# EAGLE design plus-alt (EAGLE 9.6.2)
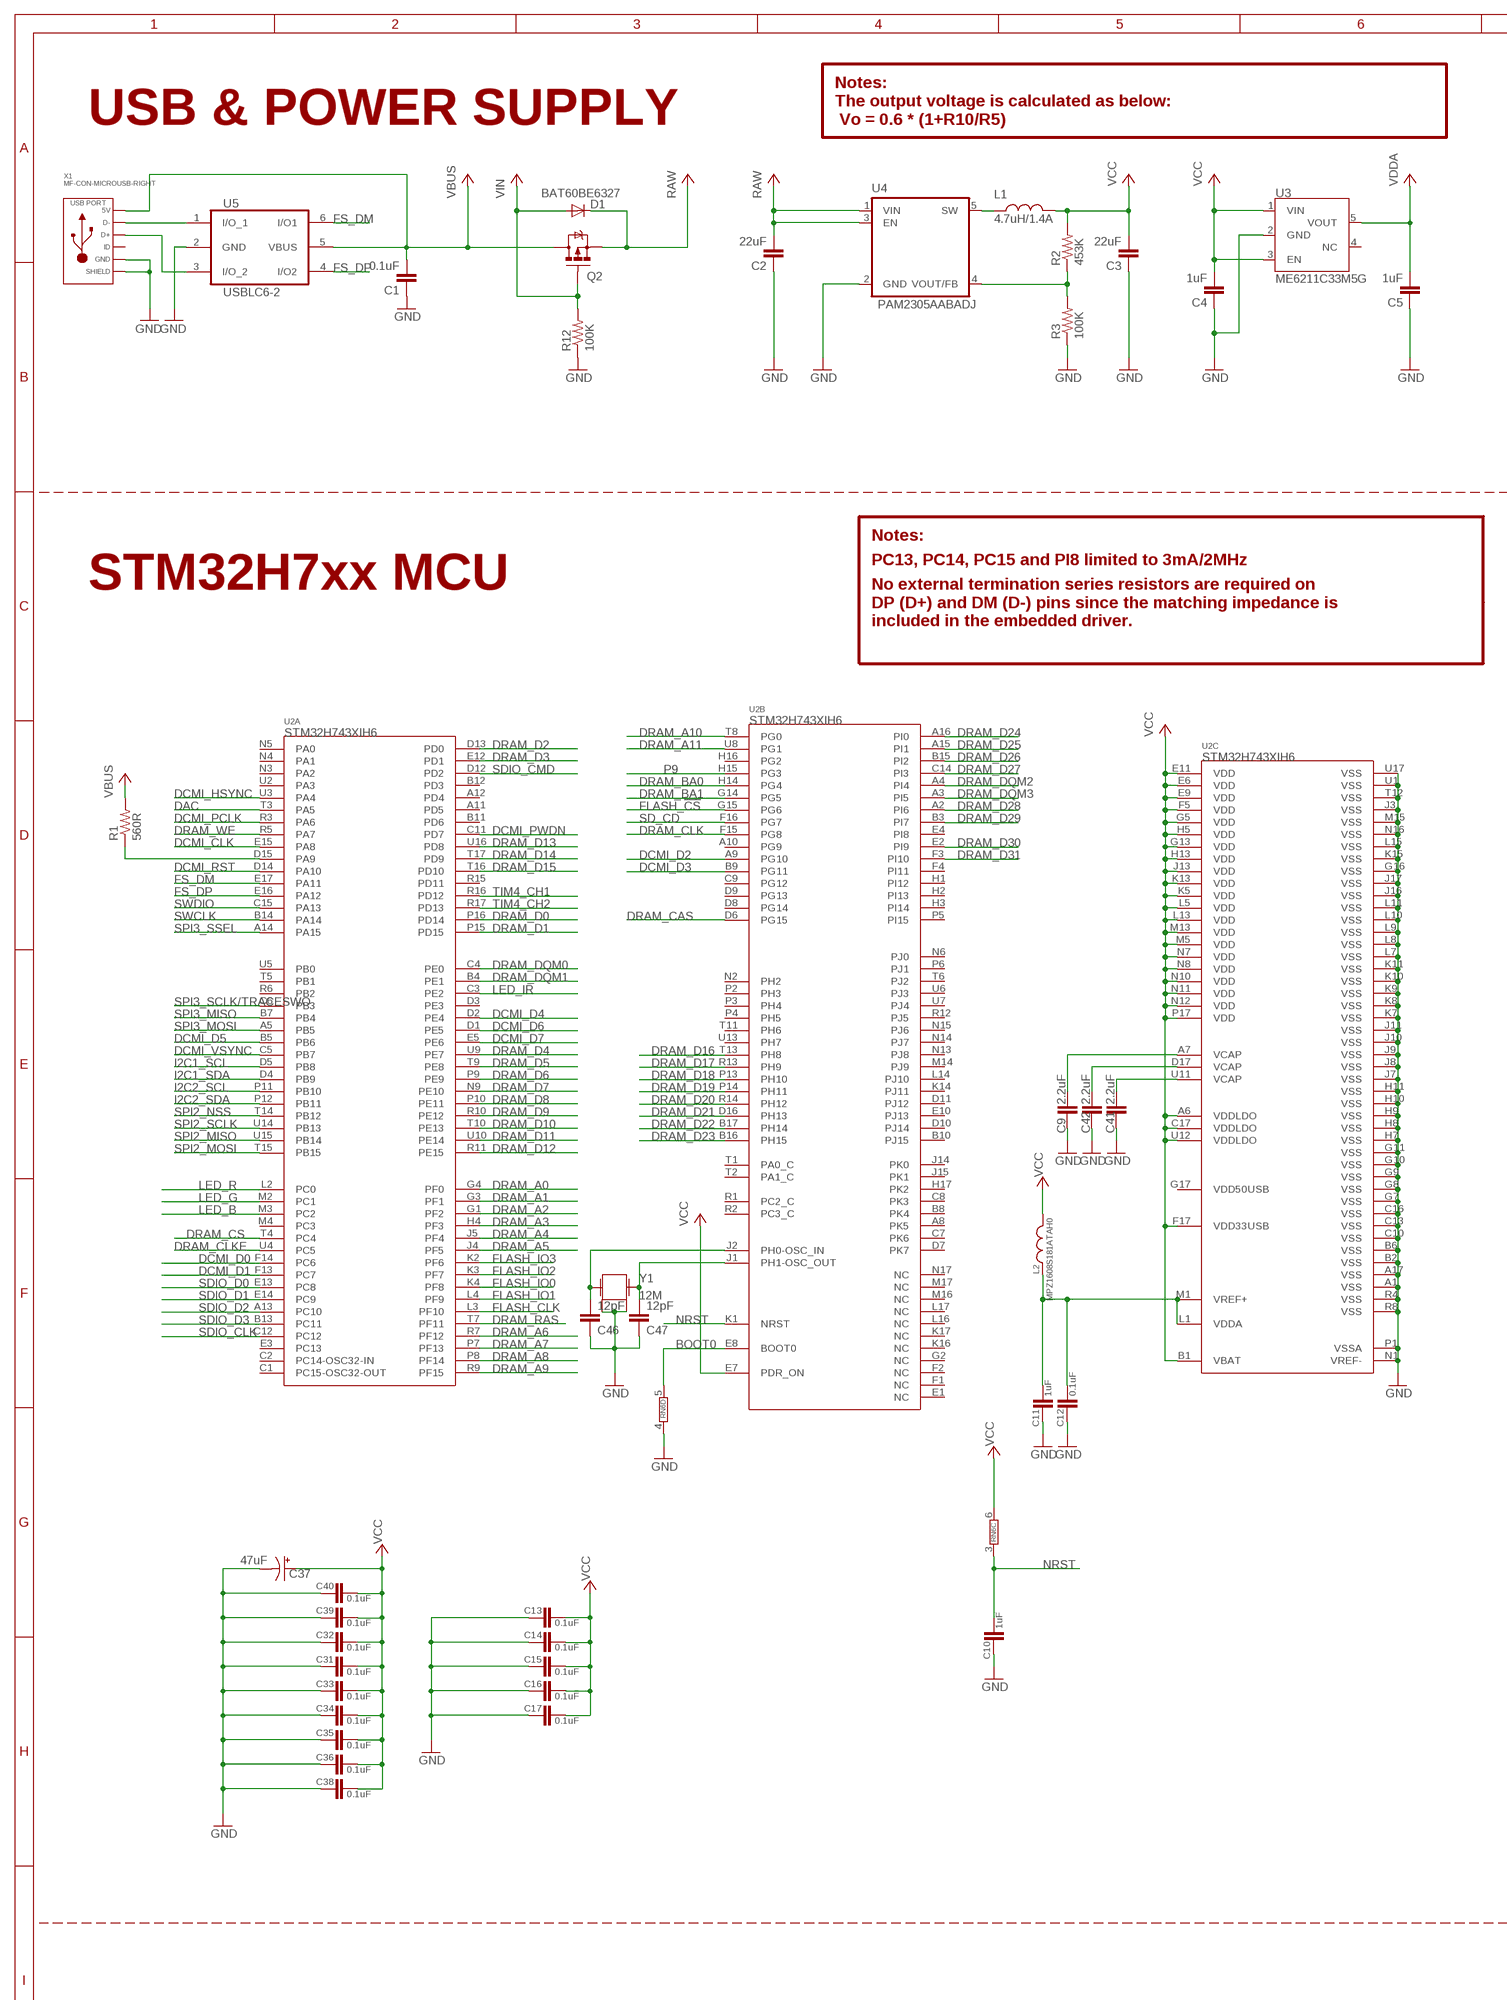
[diagram p0: schematic, sheet 1, part 1 of 2]
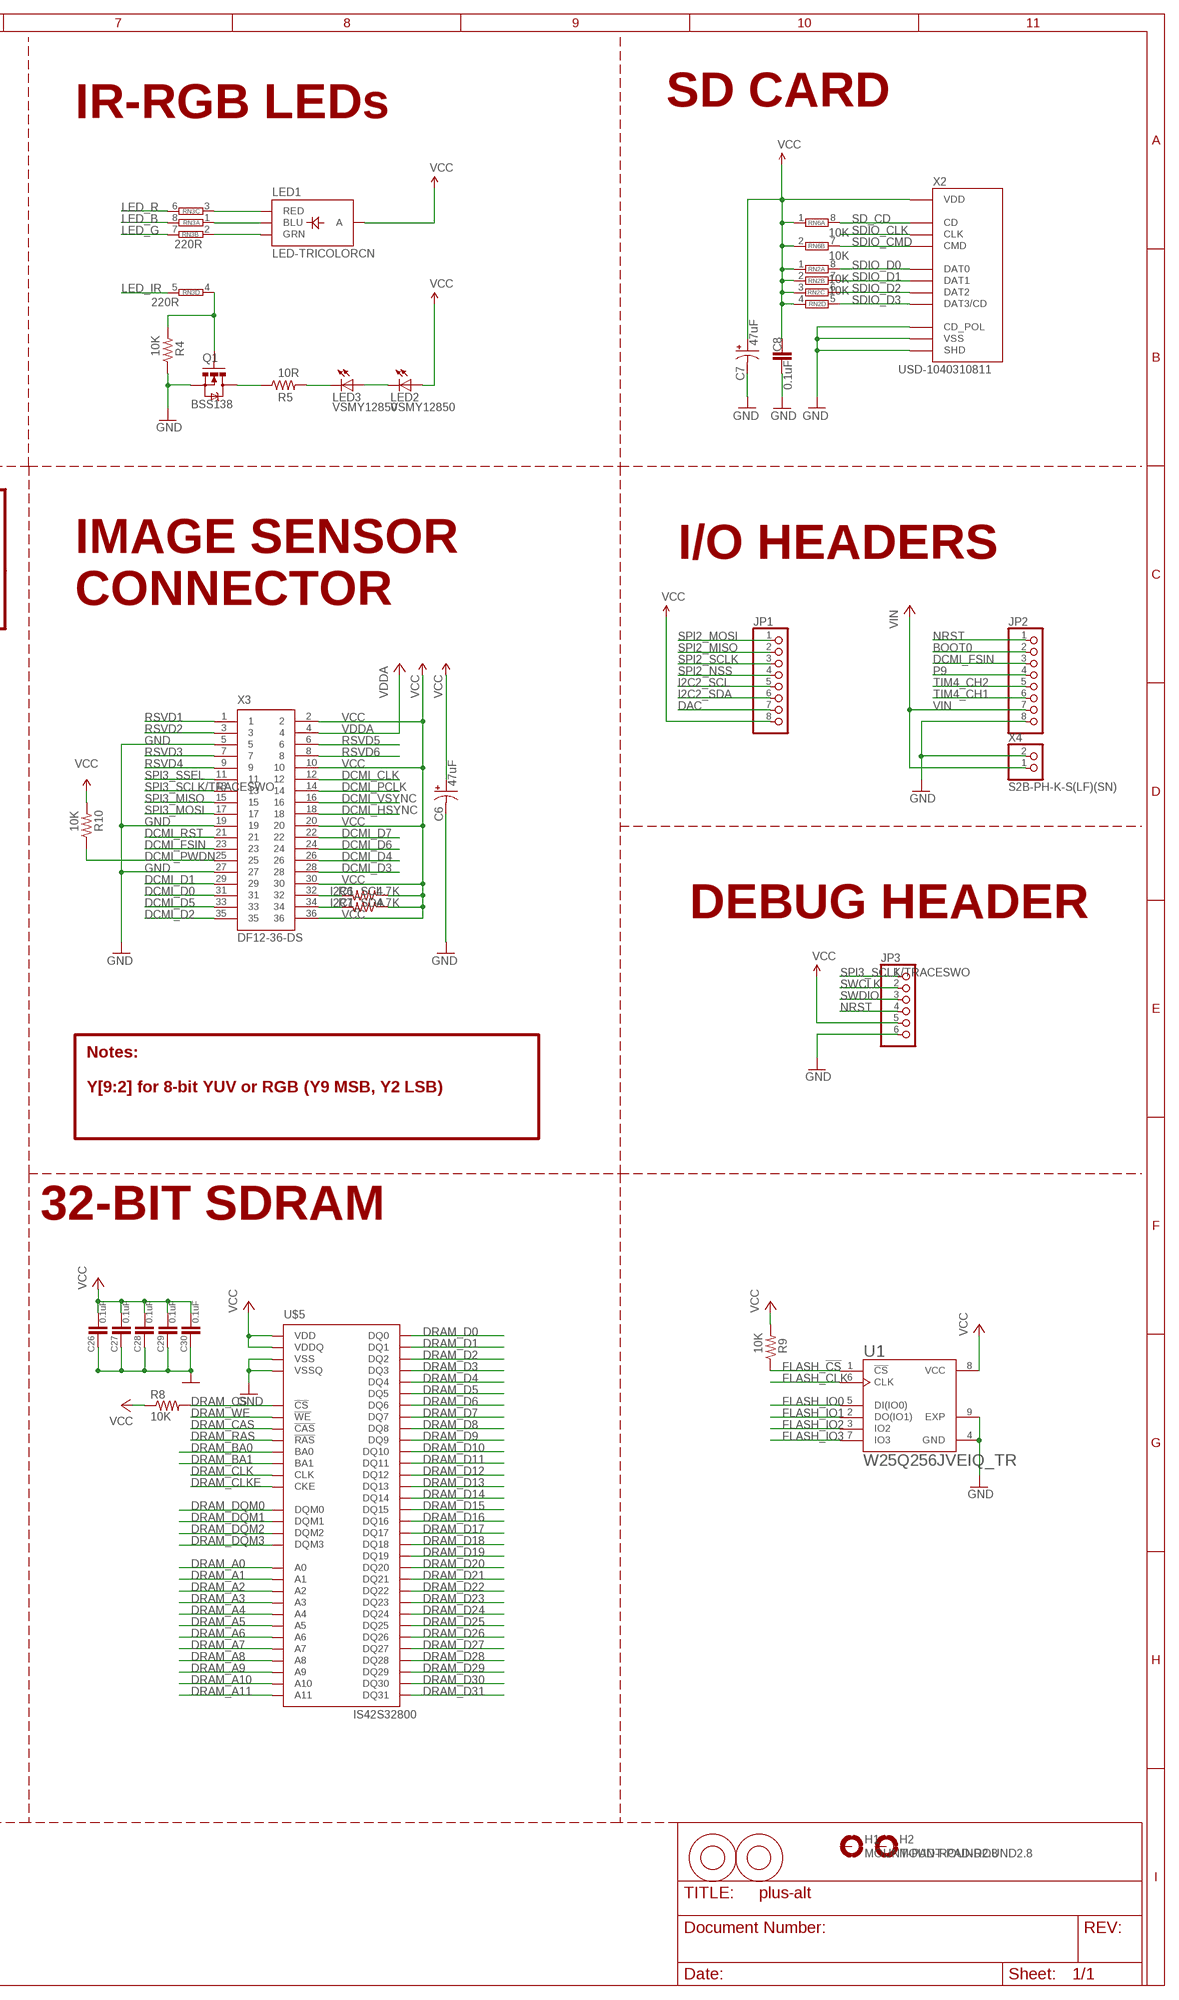
[diagram p1: schematic, sheet 1, part 2 of 2]

## Parts
C1  0.1uF  CAP0402-CAP  [0402-CAP]
C2  22uF  CAP0805  [0805]
C3  22uF  CAP0805  [0805]
C4  1uF  CAP0402-CAP  [0402-CAP]
C5  1uF  CAP0402-CAP  [0402-CAP]
C6  47uF  CAP_POL1206  [EIA3216]
C7  47uF  CAP_POL1206  [EIA3216]
C8  0.1uF  CAP0402-CAP  [0402-CAP]
C9  2.2uF  CAP0402-CAP  [0402-CAP]
C10  1uF  CAP0402-CAP  [0402-CAP]
C11  1uF  CAP0402-CAP  [0402-CAP]
C12  0.1uF  CAP0402-CAP  [0402-CAP]
C13  0.1uF  CAP0402-CAP  [0402-CAP]
C14  0.1uF  CAP0402-CAP  [0402-CAP]
C15  0.1uF  CAP0402-CAP  [0402-CAP]
C16  0.1uF  CAP0402-CAP  [0402-CAP]
C17  0.1uF  CAP0402-CAP  [0402-CAP]
C26  0.1uF  CAP0402-CAP  [0402-CAP]
C27  0.1uF  CAP0402-CAP  [0402-CAP]
C28  0.1uF  CAP0402-CAP  [0402-CAP]
C29  0.1uF  CAP0402-CAP  [0402-CAP]
C30  0.1uF  CAP0402-CAP  [0402-CAP]
C31  0.1uF  CAP0402-CAP  [0402-CAP]
C32  0.1uF  CAP0402-CAP  [0402-CAP]
C33  0.1uF  CAP0402-CAP  [0402-CAP]
C34  0.1uF  CAP0402-CAP  [0402-CAP]
C35  0.1uF  CAP0402-CAP  [0402-CAP]
C36  0.1uF  CAP0402-CAP  [0402-CAP]
C37  47uF  CAP_POL1206  [EIA3216]
C38  0.1uF  CAP0402-CAP  [0402-CAP]
C39  0.1uF  CAP0402-CAP  [0402-CAP]
C40  0.1uF  CAP0402-CAP  [0402-CAP]
C41  2.2uF  CAP0402-CAP  [0402-CAP]
C42  2.2uF  CAP0402-CAP  [0402-CAP]
C46  12pF  CAP0402-CAP  [0402-CAP]
C47  12pF  CAP0402-CAP  [0402-CAP]
D1  BAT60BE6327  DIODESOD  [SOD-323]
H1  MOUNT-PAD-ROUND2.8  [2,8-PAD]
H2  MOUNT-PAD-ROUND2.8  [2,8-PAD]
JP1  PINHD-1X8  [1X08]
JP2  PINHD-1X8  [1X08]
JP3  PINHD-1X6  [1X06]
L1  4.7uH/1.4A  INDUCTOR1007  [1007]
L2  MPZ1608S181ATAH0  INDUCTOR0402  [C0402]
LED1  LED-TRICOLORCN  [LED-TRICOLOR-SMD]
LED2  VSMY12850  LED1206  [LED-1206]
LED3  VSMY12850  LED1206  [LED-1206]
M1  9774030243R  9774030151R  [9774030151R]
M2  9774030243R  9774030151R  [9774030151R]
Q1  BSS138  MOSFET-NCHANNELSMD  [SOT23-3]
Q2  AO3401  MOSFET-PCHANNELSMD  [SOT23-3]
R1  560R  RESISTOR0402-RES  [0402-RES]
R2  453K  RESISTOR0402-RES  [0402-RES]
R3  100K  RESISTOR0402-RES  [0402-RES]
R4  10K  RESISTOR0402-RES  [0402-RES]
R5  10R  RESISTOR0402-RES  [0402-RES]
R6  4.7K  RESISTOR0402-RES  [0402-RES]
R7  4.7K  RESISTOR0402-RES  [0402-RES]
R8  10K  RESISTOR0402-RES  [0402-RES]
R9  10K  RESISTOR0402-RES  [0402-RES]
R10  10K  RESISTOR0402-RES  [0402-RES]
R12  100K  RESISTOR0402-RES  [0402-RES]
RN2  10K  4R-NEXBV8V  [EXBV8V]
RN3  220R  4R-NEXBV8V  [EXBV8V]
RN6  10K  4R-NEXBV8V  [EXBV8V]
U1  W25Q256JVEIQ_TR  [SON127P800X600X80-9N]
U2  *  STM32H743XIH6STM32H743XIH6_TFBGA240+25  [TFBGA240+25]
U3  ME6211C33M5G  ME6211TSOT-5  [SOT23-5]
U4  PAM2305AABADJ  PAM2305AAB330  [TSOT25]
U5  USBLC6-2  USBLC6-2SC6  [SOT-23-6L]
U$5  IS42S32800  [BGA90]
X1  MF-CON-MICROUSB-RIGHT  USB_MICRO_RIGHT  [MICROUSB-RIGHT]
X2  USD-1040310811  [1040310811]
X3  DF12-36-DS  [DF12-36-DS]
X4  S2B-PH-K-S(LF)(SN)  JST_2PIN-THM-RA  [JST-PH-2-THM-RA]
Y1  12M  CRYSTAL2.5X2.0  [CRYSTAL-2.5X2.0]

## Nets
BOOT0: JP2.2 RN6.5 U2.E8(B:BOOT0)
DAC: JP1.7 U2.T3(A:PA5)
DCMI_CLK: U2.E15(A:PA8) X3.12
DCMI_D0 [dcmi_data]: U2.F14(A:PC6) X3.31
DCMI_D1 [dcmi_data]: U2.F13(A:PC7) X3.29
DCMI_D2 [dcmi_data]: U2.A9(B:PG10) X3.35
DCMI_D3 [dcmi_data]: U2.B9(B:PG11) X3.28
DCMI_D4 [dcmi_data]: U2.D2(A:PE4) X3.26
DCMI_D5 [dcmi_data]: U2.B5(A:PB6) X3.33
DCMI_D6 [dcmi_data]: U2.D1(A:PE5) X3.24
DCMI_D7 [dcmi_data]: U2.E5(A:PE6) X3.22
DCMI_FSIN: JP2.3 X3.23
DCMI_HSYNC: U2.U3(A:PA4) X3.18
DCMI_PCLK: U2.R3(A:PA6) X3.14
DCMI_PWDN: R10.1 U2.C11(A:PD7) X3.25
DCMI_RST: U2.D14(A:PA10) X3.21
DCMI_VSYNC: U2.C5(A:PB7) X3.16
DRAM_A0 [sdram_cmd]: U2.G4(A:PF0) U$5.G8(A0)
DRAM_A1 [sdram_cmd]: U2.G3(A:PF1) U$5.G9(A1)
DRAM_A2 [sdram_cmd]: U2.G1(A:PF2) U$5.F7(A2)
DRAM_A3 [sdram_cmd]: U2.H4(A:PF3) U$5.F3(A3)
DRAM_A4 [sdram_cmd]: U2.J5(A:PF4) U$5.G1(A4)
DRAM_A5 [sdram_cmd]: U2.J4(A:PF5) U$5.G2(A5)
DRAM_A6 [sdram_cmd]: U2.R7(A:PF12) U$5.G3(A6)
DRAM_A7 [sdram_cmd]: U2.P7(A:PF13) U$5.H1(A7)
DRAM_A8 [sdram_cmd]: U2.P8(A:PF14) U$5.H2(A8)
DRAM_A9 [sdram_cmd]: U2.R9(A:PF15) U$5.J3(A9)
DRAM_A10 [sdram_cmd]: U2.T8(B:PG0) U$5.G7(A10)
DRAM_A11 [sdram_cmd]: U2.U8(B:PG1) U$5.H9(A11)
DRAM_BA0 [sdram_cmd]: U2.H14(B:PG4) U$5.J7(BA0)
DRAM_BA1 [sdram_cmd]: U2.G14(B:PG5) U$5.H8(BA1)
DRAM_CAS [sdram_cmd]: U2.D6(B:PG15) U$5.K7(!CAS)
DRAM_CLK [sdram_cmd]: U2.F15(B:PG8) U$5.J1(CLK)
DRAM_CLKE [sdram_cmd]: U2.U4(A:PC5) U$5.J2(CKE)
DRAM_CS [sdram_cmd]: R8.2 U2.T4(A:PC4) U$5.J8(!CS)
DRAM_D0 [sdram_data]: U2.P16(A:PD14) U$5.R8(DQ0)
DRAM_D1 [sdram_data]: U2.P15(A:PD15) U$5.N7(DQ1)
DRAM_D2 [sdram_data]: U2.D13(A:PD0) U$5.R9(DQ2)
DRAM_D3 [sdram_data]: U2.E12(A:PD1) U$5.N8(DQ3)
DRAM_D4 [sdram_data]: U2.U9(A:PE7) U$5.P9(DQ4)
DRAM_D5 [sdram_data]: U2.T9(A:PE8) U$5.M8(DQ5)
DRAM_D6 [sdram_data]: U2.P9(A:PE9) U$5.M7(DQ6)
DRAM_D7 [sdram_data]: U2.N9(A:PE10) U$5.L8(DQ7)
DRAM_D8 [sdram_data]: U2.P10(A:PE11) U$5.L2(DQ8)
DRAM_D9 [sdram_data]: U2.R10(A:PE12) U$5.M3(DQ9)
DRAM_D10 [sdram_data]: U2.T10(A:PE13) U$5.M2(DQ10)
DRAM_D11 [sdram_data]: U2.U10(A:PE14) U$5.P1(DQ11)
DRAM_D12 [sdram_data]: U2.R11(A:PE15) U$5.N2(DQ12)
DRAM_D13 [sdram_data]: U2.U16(A:PD8) U$5.R1(DQ13)
DRAM_D14 [sdram_data]: U2.T17(A:PD9) U$5.N3(DQ14)
DRAM_D15 [sdram_data]: U2.T16(A:PD10) U$5.R2(DQ15)
DRAM_D16 [sdram_data]: U2.T13(B:PH8) U$5.E8(DQ16)
DRAM_D17 [sdram_data]: U2.R13(B:PH9) U$5.D7(DQ17)
DRAM_D18 [sdram_data]: U2.P13(B:PH10) U$5.D8(DQ18)
DRAM_D19 [sdram_data]: U2.P14(B:PH11) U$5.B9(DQ19)
DRAM_D20 [sdram_data]: U2.R14(B:PH12) U$5.C8(DQ20)
DRAM_D21 [sdram_data]: U2.D16(B:PH13) U$5.A9(DQ21)
DRAM_D22 [sdram_data]: U2.B17(B:PH14) U$5.C7(DQ22)
DRAM_D23 [sdram_data]: U2.B16(B:PH15) U$5.A8(DQ23)
DRAM_D24 [sdram_data]: U2.A16(B:PI0) U$5.A2(DQ24)
DRAM_D25 [sdram_data]: U2.A15(B:PI1) U$5.C3(DQ25)
DRAM_D26 [sdram_data]: U2.B15(B:PI2) U$5.A1(DQ26)
DRAM_D27 [sdram_data]: U2.C14(B:PI3) U$5.C2(DQ27)
DRAM_D28 [sdram_data]: U2.A2(B:PI6) U$5.B1(DQ28)
DRAM_D29 [sdram_data]: U2.B3(B:PI7) U$5.D2(DQ29)
DRAM_D30 [sdram_data]: U2.E2(B:PI9) U$5.D3(DQ30)
DRAM_D31 [sdram_data]: U2.F3(B:PI10) U$5.E2(DQ31)
DRAM_DQM0 [sdram_cmd]: U2.C4(A:PE0) U$5.K9(DQM0)
DRAM_DQM1 [sdram_cmd]: U2.B4(A:PE1) U$5.K1(DQM1)
DRAM_DQM2 [sdram_cmd]: U2.A4(B:PI4) U$5.F8(DQM2)
DRAM_DQM3 [sdram_cmd]: U2.A3(B:PI5) U$5.F2(DQM3)
DRAM_RAS [sdram_cmd]: U2.T7(A:PF11) U$5.J9(!RAS)
DRAM_WE [sdram_cmd]: U2.R5(A:PA7) U$5.K8(!WE)
FLASH_!CS: R9.1 U1.1(!CS) U2.G15(B:PG6)
FLASH_CLK: U1.6(CLK) U2.L3(A:PF10)
FLASH_IO0: U1.5(DI(IO0)) U2.K4(A:PF8)
FLASH_IO1: U1.2(DO(IO1)) U2.L4(A:PF9)
FLASH_IO2: U1.3(IO2) U2.K3(A:PF7)
FLASH_IO3: U1.7(IO3) U2.K2(A:PF6)
FS_DM: U2.E17(A:PA11) U5.6(I/O1)
FS_DP: U2.E16(A:PA12) U5.4(I/O2)
GND [gnd]: C1.1 C2.1 C3.1 C4.1 C5.1 C6.C(-) C7.C(-) C8.2 C9.2 C10.2 C11.2 C12.2 C13.2 C14.2 C15.2 C16.2 C17.2 C26.2 C27.2 C28.2 C29.2 C30.2 C31.2 C32.2 C33.2 C34.2 C35.2 C36.2 C37.C(-) C38.2 C39.2 C40.2 C41.2 C42.2 C46.1 C47.1 JP2.8 JP3.6 Q1.2(S) R3.1 R4.1 R12.1 RN6.4 U1.4(GND) U1.9(EXP) U2.A1(C:VSS) U2.A17(C:VSS) U2.B2(C:VSS) U2.B6(C:VSS) U2.C10(C:VSS) U2.C13(C:VSS) U2.C16(C:VSS) U2.G7(C:VSS) U2.G8(C:VSS) U2.G9(C:VSS) U2.G10(C:VSS) U2.G11(C:VSS) U2.G16(C:VSS) U2.H7(C:VSS) U2.H8(C:VSS) U2.H9(C:VSS) U2.H10(C:VSS) U2.H11(C:VSS) U2.J3(C:VSS) U2.J7(C:VSS) U2.J8(C:VSS) U2.J9(C:VSS) U2.J10(C:VSS) U2.J11(C:VSS) U2.J16(C:VSS) U2.J17(C:VSS) U2.K7(C:VSS) U2.K8(C:VSS) U2.K9(C:VSS) U2.K10(C:VSS) U2.K11(C:VSS) U2.K15(C:VSS) U2.L7(C:VSS) U2.L8(C:VSS) U2.L9(C:VSS) U2.L10(C:VSS) U2.L11(C:VSS) U2.L15(C:VSS) U2.M15(C:VSS) U2.N1(C:VREF-) U2.N16(C:VSS) U2.P1(C:VSSA) U2.R4(C:VSS) U2.R8(C:VSS) U2.T12(C:VSS) U2.U1(C:VSS) U2.U17(C:VSS) U3.2(GND) U4.2(GND) U5.2(GND) U$5.A3(VSS) U$5.B3(VSSQ) U$5.B8(VSSQ) U$5.C1(VSSQ) U$5.D1(VSSQ) U$5.E9(VSSQ) U$5.F1(VSS) U$5.L3(VSS) U$5.L9(VSSQ) U$5.M1(VSSQ) U$5.N1(VSSQ) U$5.P3(VSSQ) U$5.P8(VSSQ) U$5.R3(VSS) X1.5(GND) X1.S1(SLD) X1.S2(SLD) X1.S3(SLD) X1.S4(SLD) X1.S5(SLD) X1.S6(SLD) X2.CD$2(CD_POL) X2.G$1(SHD) X2.G$2(SHD) X2.G$3(SHD) X2.G$4(SHD) X2.P$6(VSS) X3.5 X3.19 X3.27 X4.2 Y1.2 Y1.4
I2C1_SCL: R6.2 U2.D5(A:PB8) X3.32
I2C1_SDA: R7.2 U2.D4(A:PB9) X3.34
I2C2_SCL: JP1.5 U2.P11(A:PB10)
I2C2_SDA: JP1.6 U2.P12(A:PB11)
LED_B: RN3.8 U2.M3(A:PC2)
LED_G: RN3.7 U2.M2(A:PC1)
LED_IR: RN3.5 U2.C3(A:PE2)
LED_R: RN3.6 U2.L2(A:PC0)
N$2: U5.1(I/O_1) X1.2(D-)
N$4: U5.3(I/O_2) X1.3(D+)
N$5: Q1.1(G) R4.2 RN3.4
N$6: LED1.B(BLU) RN3.1
N$8: LED1.R(RED) RN3.3
N$9: LED1.G(GRN) RN3.2
N$10: LED3.C R5.2
N$13: R2.1 R3.2 U4.4(VOUT/FB)
N$14: Q1.3(D) R5.1
N$17: LED2.C LED3.A
N$30: C11.1 C12.1 L2.1 U2.L1(C:VDDA) U2.M1(C:VREF+)
N$32: R1.1 U2.D15(A:PA9)
N$33: C46.2 U2.J2(B:PH0-OSC_IN) Y1.3
N$34: C47.2 U2.J1(B:PH1-OSC_OUT) Y1.1
NRST: C10.1 JP2.1 JP3.4 RN6.3 U2.K1(B:NRST)
P9: JP2.4 U2.H15(B:PG3)
RAW: C2.2 D1.1(C) Q2.2(S) U4.1(VIN) U4.3(EN)
RSVD1: X3.1
RSVD2: X3.3
RSVD3: X3.7
RSVD4: X3.9
RSVD5: X3.6
RSVD6: X3.8
SD_CD: RN6.8 U2.F16(B:PG7) X2.CD$1(CD)
SDIO_CLK: U2.C12(A:PC12) X2.P$5(CLK)
SDIO_CMD: RN6.7 U2.D12(A:PD2) X2.P$3(CMD)
SDIO_D0: RN2.8 U2.E13(A:PC8) X2.P$7(DAT0)
SDIO_D1: RN2.7 U2.E14(A:PC9) X2.P$8(DAT1)
SDIO_D2: RN2.6 U2.A13(A:PC10) X2.P$1(DAT2)
SDIO_D3: RN2.5 U2.B13(A:PC11) X2.P$2(DAT3/CD)
SPI2_MISO: JP1.2 U2.U15(A:PB14)
SPI2_MOSI: JP1.1 U2.T15(A:PB15)
SPI2_NSS: JP1.4 U2.T14(A:PB12)
SPI2_SCLK: JP1.3 U2.U14(A:PB13)
SPI3_MISO: U2.B7(A:PB4) X3.15
SPI3_MOSI: U2.A5(A:PB5) X3.17
SPI3_SCLK/TRACESWO: JP3.1 U2.C6(A:PB3) X3.13
SPI3_SSEL: U2.A14(A:PA15) X3.11
SW: L1.1 U4.5(SW)
SWCLK: JP3.2 U2.B14(A:PA14)
SWDIO: JP3.3 U2.C15(A:PA13)
TIM4_CH1: JP2.6 U2.R16(A:PD12)
TIM4_CH2: JP2.5 U2.R17(A:PD13)
VBUS [power]: C1.2 Q2.3(D) R1.2 U5.5(VBUS) X1.1(5V)
VCAP1: C9.1 U2.A7(C:VCAP)
VCAP3: C41.1 U2.U11(C:VCAP)
VCAP4: C42.1 U2.D17(C:VCAP)
VCC [power]: C3.2 C4.2 C6.A(+) C7.A(+) C8.1 C13.1 C14.1 C15.1 C16.1 C17.1 C26.1 C27.1 C28.1 C29.1 C30.1 C31.1 C32.1 C33.1 C34.1 C35.1 C36.1 C37.A(+) C38.1 C39.1 C40.1 JP1.8 JP3.5 L1.2 L2.2 LED1.V(A) LED2.A R2.2 R6.1 R7.1 R8.1 R9.2 R10.2 RN2.1 RN2.2 RN2.3 RN2.4 RN6.1 RN6.2 RN6.6 U1.8(VCC) U2.A6(C:VDDLDO) U2.B1(C:VBAT) U2.C17(C:VDDLDO) U2.E6(C:VDD) U2.E7(B:PDR_ON) U2.E9(C:VDD) U2.E11(C:VDD) U2.F5(C:VDD) U2.F17(C:VDD33USB) U2.G5(C:VDD) U2.G13(C:VDD) U2.H5(C:VDD) U2.H13(C:VDD) U2.J13(C:VDD) U2.K5(C:VDD) U2.K13(C:VDD) U2.L5(C:VDD) U2.L13(C:VDD) U2.M5(C:VDD) U2.M13(C:VDD) U2.N7(C:VDD) U2.N8(C:VDD) U2.N10(C:VDD) U2.N11(C:VDD) U2.N12(C:VDD) U2.P17(C:VDD) U2.U12(C:VDDLDO) U3.1(VIN) U3.3(EN) U$5.A7(VDD) U$5.B2(VDDQ) U$5.B7(VDDQ) U$5.C9(VDDQ) U$5.D9(VDDQ) U$5.E1(VDDQ) U$5.F9(VDD) U$5.L1(VDDQ) U$5.L7(VDD) U$5.M9(VDDQ) U$5.N9(VDDQ) U$5.P2(VDDQ) U$5.P7(VDDQ) U$5.R7(VDD) X2.P$4(VDD) X3.2 X3.10 X3.20 X3.30 X3.36
VDDA [power]: C5.2 U3.5(VOUT) X3.4
VIN: D1.2(A) JP2.7 Q2.1(G) R12.2 X4.1
Unconnected: H1.B2,8(MOUNT) H2.B2,8(MOUNT) U2.A8(B:PK5) U2.A10(B:PG9) U2.A11(A:PD5) U2.A12(A:PD4) U2.B8(B:PK4) U2.B10(B:PJ15) U2.B11(A:PD6) U2.B12(A:PD3) U2.C1(A:PC15-OSC32-OUT) U2.C2(A:PC14-OSC32-IN) U2.C7(B:PK6) U2.C8(B:PK3) U2.C9(B:PG12) U2.D3(A:PE3) U2.D7(B:PK7) U2.D8(B:PG14) U2.D9(B:PG13) U2.D10(B:PJ14) U2.D11(B:PJ12) U2.E1(B:NC) U2.E3(A:PC13) U2.E4(B:PI8) U2.E10(B:PJ13) U2.F1(B:NC) U2.F2(B:NC) U2.F4(B:PI11) U2.G2(B:NC) U2.G17(C:VDD50USB) U2.H1(B:PI12) U2.H2(B:PI13) U2.H3(B:PI14) U2.H16(B:PG2) U2.H17(B:PK2) U2.J14(B:PK0) U2.J15(B:PK1) U2.K14(B:PJ11) U2.K16(B:NC) U2.K17(B:NC) U2.L14(B:PJ10) U2.L16(B:NC) U2.L17(B:NC) U2.M4(A:PC3) U2.M14(B:PJ9) U2.M16(B:NC) U2.M17(B:NC) U2.N2(B:PH2) U2.N3(A:PA2) U2.N4(A:PA1) U2.N5(A:PA0) U2.N6(B:PJ0) U2.N13(B:PJ8) U2.N14(B:PJ7) U2.N15(B:PJ6) U2.N17(B:NC) U2.P2(B:PH3) U2.P3(B:PH4) U2.P4(B:PH5) U2.P5(B:PI15) U2.P6(B:PJ1) U2.R1(B:PC2_C) U2.R2(B:PC3_C) U2.R6(A:PB2) U2.R12(B:PJ5) U2.R15(A:PD11) U2.T1(B:PA0_C) U2.T2(B:PA1_C) U2.T5(A:PB1) U2.T6(B:PJ2) U2.T11(B:PH6) U2.U2(A:PA3) U2.U5(A:PB0) U2.U6(B:PJ3) U2.U7(B:PJ4) U2.U13(B:PH7) U3.4(NC) X1.4(ID)

## Notes on the sheet
- Notes:
- USB & POWER SUPPLY | SD CARD
- The output voltage is calculated as below:
   Vo = 0.6 * (1+R10/R5)
- IR-RGB LEDs
- Notes:
- PC13, PC14, PC15 and PI8 limited to 3mA/2MHz
- STM32H7xx MCU | I/O HEADERS
- No external termination series resistors are required on
  DP (D+) and DM (D-) pins since the matching impedance is
  included in the embedded driver.
- IMAGE SENSOR
  CONNECTOR
- DEBUG HEADER
- Notes:
- Y[9:2] for 8-bit YUV or RGB (Y9 MSB, Y2 LSB)
- 32-BIT SDRAM

## Library data of the parts
C1-C5 C8-C17 C26-C36 C38-C42 C46 C47 = sfe:CAP: Capacitor Standard 0603 ceramic capacitor, and 0.1" leaded capacitor.
C6 C7 C37 = sfe:CAP_POL: Capacitor Polarized These are standard SMD and PTH capacitors. Normally 10uF, 47uF, and 100uF in electrolytic and tantalum varieties. Always verify the external diameter of the through hole cap, it varies with capacity, voltage, and manufacturer. The EIA devices should be standard.
D1 = sfe:DIODE: Diode These are standard reverse protection diodes and small signal diodes. SMA package can handle up to about 1A. SOD-323 can handle about 200mA. What the SOD-323 package when ordering, there are some mfgs out there that are 5-pin packages.
H1 H2 = holes:MOUNT-PAD-ROUND: MOUNTING PAD, round
JP1 JP2 = pinhead:PINHD-1X8: PIN HEADER
JP3 = pinhead:PINHD-1X6: PIN HEADER
L1 L2 = sfe:INDUCTOR: Inductors Basic Inductor/Choke - 0603 and 1206. Footprints are not proven and vary greatly between part numbers.
LED1 = sfe:LED-TRICOLOR: Tri-Color LED SMD Proven layout and schematic for triple color LED in SMD package - common anode. Spark Fun Electronics SKU : COM-07844
LED2 LED3 = sfe:LED: LEDs Standard schematic elements and footprints for 5mm, 3mm, 1206, and 0603 sized LEDs. 5mm - Spark Fun Electronics SKU : COM-00529 (and others)
M1 M2 = STANDOFFS:9774030151R
Q1 = sfe:MOSFET-NCHANNEL
Q2 = sfe:MOSFET-PCHANNEL
R1-R10 R12 = sfe:RESISTOR: Resistor Basic schematic elements and footprints for 0603, 1206, and PTH resistors.
RN2 RN3 RN6 = resistor-dil:4R-N: Array Chip Resistor Source: RS Component / Phycomp; OC_FARNELL: unknown; OC_NEWARK: unknown
U1 = W25Q256JVEIQ_TR:W25Q256JVEIQ_TR: Ic Flash 256mbit 104mhz 8wson Check prices <https://pricing.snapeda.com/parts/W25Q256JVEIQ%20TR/Winbond/view-part?ref=eda>; AVAILABILITY: In Stock; DESCRIPTION: FLASH - NOR Memory IC 256Mb (32M x 8) SPI - Quad I/O 133MHz 8-WSON (8x6); MF: Winbond; MP: W25Q256JVEIQ TR; PACKAGE: WSON-8 Winbond; PRICE: None
U2 = openMV-h7update:STM32H743XIH6: ARMR CortexR-M7 STM32H7 Microcontroller IC 32-Bit 480MHz 2MB (2M x 8) FLASH 240+25-TFBGA (14x14); COST: 15.83; DISTRIBUTOR: DIGIKEY; DISTRIBUTOR_P/N: 497-17724-ND; MANUFACTURER: STMicroelectronics; MANUFACTURER_P/N: STM32H743XIH6
U3 = leptonCustom:ME6211: ADP150 2.8V 150mA Linear LDO Regulator Analog Devices ADP150AUJZ-2.8-R7
U4 = regulators:PAM2305AAB330
U5 = usblc6:USBLC6-2: VERY LOW CAPACITANCE ESD PROTECTION 2 line Datasheet link <http://www.st.com/web/catalog/sense_power/FM114/CL1137/SC1489/PF93353>
U$5 = ISSI:IS42S32800
X1 = MF_Connectors:USB: Library: MF_Connectors Description: 5 Pin USB Connectors. SLD is the shield connection. Usually tied to ground through a small ferrite bead.
X2 = molex:USD-1040310811
X3 = DF12:DF12-36-DS
X4 = adafruit-updated:JST_2PIN: JST 2-Pin Connectors of various flavors SMT-RA (S2B-PH-SM4) 4UConnector #17311 SMT (B2B-PH-SM4) THM-RA (S2B-PH) THM (B2B-PH)
Y1 = mux:CRYSTAL: Crystals Various standard crystals. Proven footprints. Spark Fun Electronics SKU : COM-00534

## Net classes
1 power: width 0.305 mm
2 gnd: width 0.254 mm
3 sdram_data: width 0.089 mm, drill 0.102 mm, clearance 0.089 mm
4 sdram_cmd: width 0.089 mm, drill 0.102 mm, clearance 0.089 mm
5 dcmi_data: width 0.089 mm, drill 0.102 mm, clearance 0.089 mm

## Board
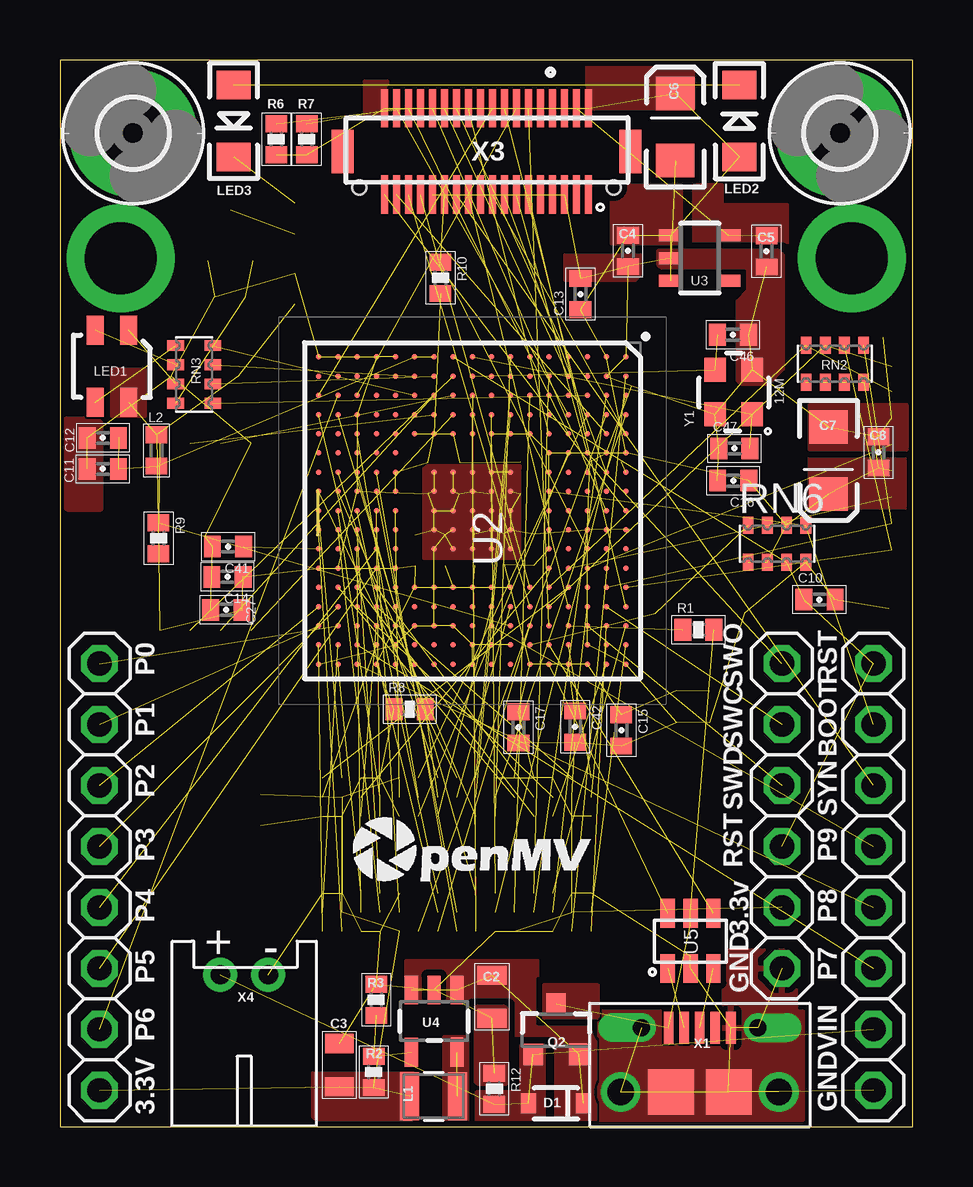
[diagram p2: board, top side]
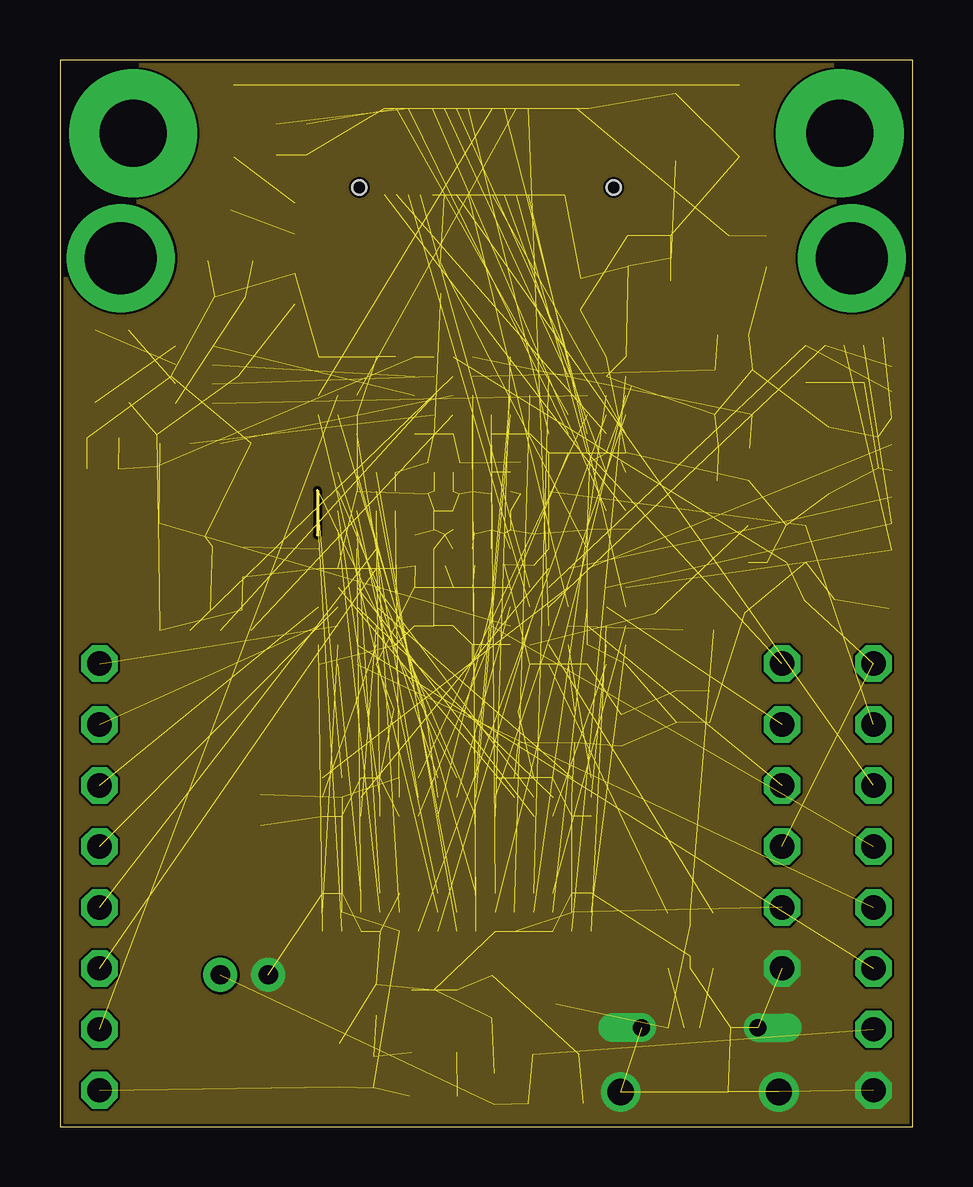
[diagram p3: board, inner layer GND]
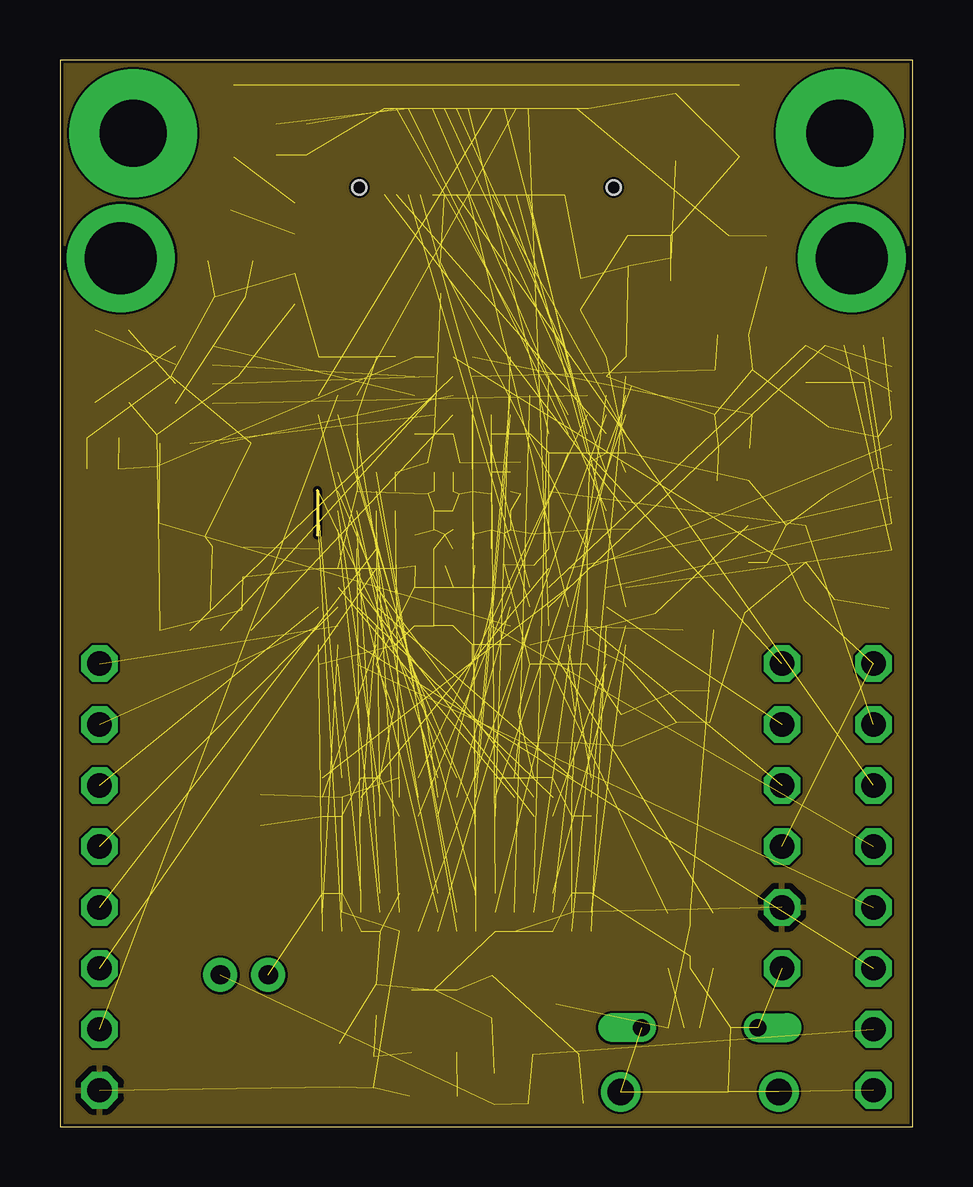
[diagram p4: board, inner layer Route5]
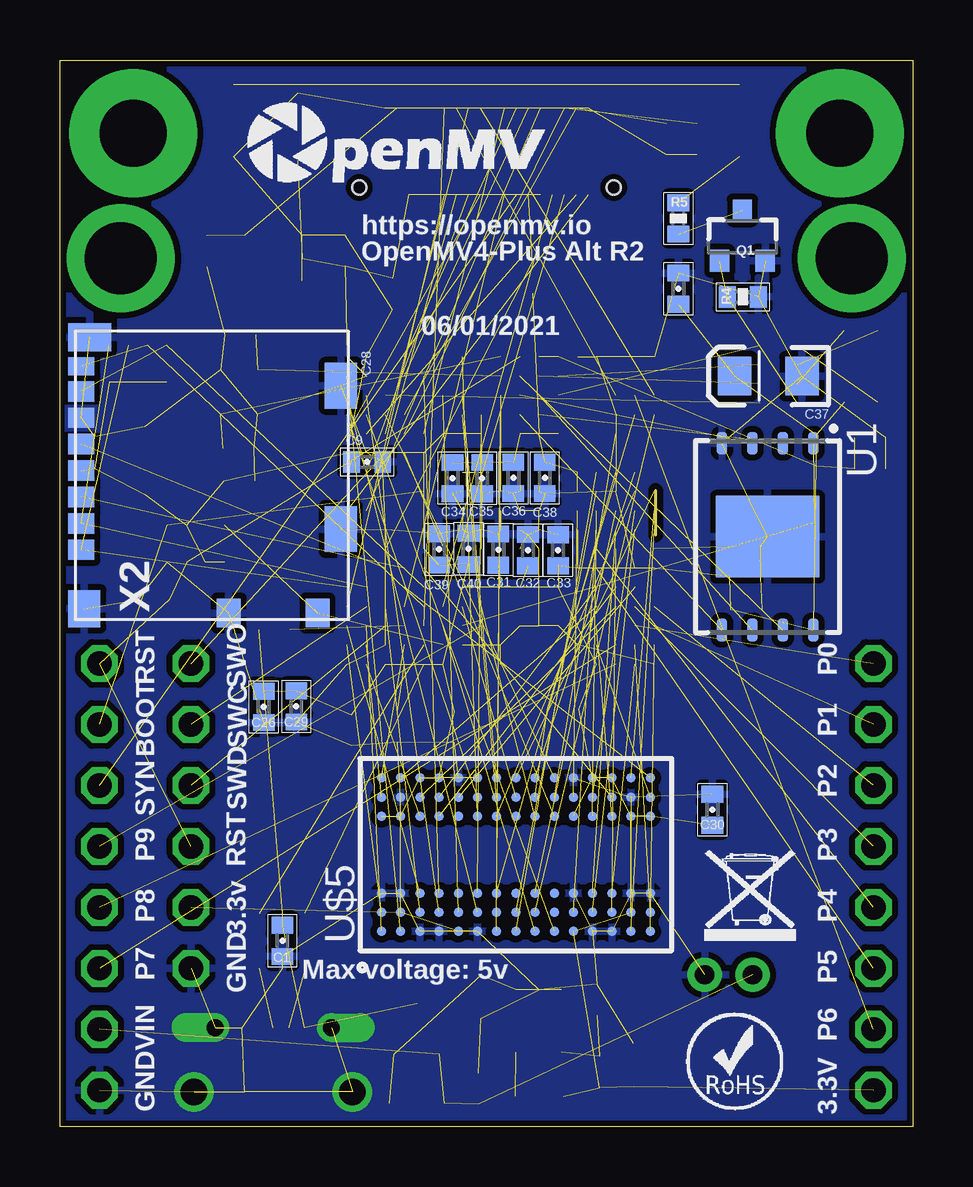
[diagram p5: board, bottom side, seen from below]

Size 35.56 x 44.45 mm. Coordinates in mm from the lower left corner, seen from the top.
Outline: 10.73,26.51 10.73,24.65
Outline: 0,44.45 0,0 35.56,0 35.56,44.45 0,44.45
Copper layers (1+2*3+4*5+16): Top 0.018mm / dielectric 0.2mm / GND 0.035mm / dielectric 0.36mm / Route3 0.035mm / dielectric 0.3mm / Route4 0.035mm / dielectric 0.36mm / Route5 0.035mm / dielectric 0.2mm / Bottom 0.018mm
Design rules "eC_6Layer_PClass6_BaseCopperO18-I35_eCDefault *": minimum track width 3.5mil, minimum drill 0.2mm, track to track 3.5mil, track to pad 5mil, pad to pad 5mil, via to via 5mil, smd to smd 0mil, copper to edge 5mil, drill to drill 10mil, minimum pad ring 10mil, minimum via ring 3mil, stop-mask expansion 2mil, vias tented up to drill 30mil, thermal gap 10mil

### Footprints (pad centres in the part's own frame; a part is rotated, then mirrored left to right if it is on the bottom)
0402-CAP = smd 0.7 x 0.9: 1 -0.65,0; 2 0.65,0
0805 = smd 0.8 x 1.2: 1 -0.9,0; 2 0.9,0
EIA3216 = smd 1.4 x 1.6: A 1.4,0; C -1.4,0
SOD-323 = smd 0.63 x 0.83: 1 -1.15,0; 2 1.15,0
2,8-PAD = drill 2.8 pad 5.334: B2,8 0,0
1X08 = drill 1.016 octagon: 1 -8.89,0; 2 -6.35,0; 3 -3.81,0; 4 -1.27,0; 5 1.27,0; 6 3.81,0; 7 6.35,0; 8 8.89,0
1X06 = drill 1.016 octagon: 1 -6.35,0; 2 -3.81,0; 3 -1.27,0; 4 1.27,0; 5 3.81,0; 6 6.35,0
1007 = smd 2 x 0.8: 1 0,1; 2 0,-1
C0402 = smd 0.7 x 0.9: 1 -0.65,0; 2 0.65,0
LED-TRICOLOR-SMD = smd 0.7 x 1.2: B 0.7,1.5; G 0.7,-1.5; R -0.7,-1.5; V -0.7,1.5
LED-1206 = smd 1.2 x 1.4: A -1.5,0; C 1.5,0
9774030151R = drill 3 pad 4.5: P$1 0,0
SOT23-3 = smd 0.8 x 0.9: 1 -0.95,-1; 2 0.95,-1; 3 0,1.1
0402-RES = smd 0.7 x 0.9: 1 -0.65,0; 2 0.65,0
EXBV8V = smd 0.45 x 0.7: 1 -1.2,-0.775; 2 -0.4,-0.775; 3 0.4,-0.775; 4 1.2,-0.775; 5 1.2,0.775; 6 0.4,0.775; 7 -0.4,0.775; 8 -1.2,0.775
SON127P800X600X80-9N = smd 0.94 x 0.44: 1 -3.895,1.905; 2 -3.895,0.635; 3 -3.895,-0.635; 4 -3.895,-1.905; 5 3.895,-1.905; 6 3.895,-0.635; 7 3.895,0.635; 8 3.895,1.905 | smd 3.4 x 4.3: 9 0,0
TFBGA240+25 = smd 0.225 x 0.225: A1 -6.4,6.4; A2 -5.6,6.4; A3 -4.8,6.4; A4 -4,6.4; A5 -3.2,6.4; A6 -2.4,6.4; A7 -1.6,6.4; A8 -0.8,6.4; A9 0,6.4; A10 0.8,6.4; A11 1.6,6.4; A12 2.4,6.4; A13 3.2,6.4; A14 4,6.4; A15 4.8,6.4; A16 5.6,6.4; A17 6.4,6.4; B1 -6.4,5.6; B2 -5.6,5.6; B3 -4.8,5.6; B4 -4,5.6; B5 -3.2,5.6; B6 -2.4,5.6; B7 -1.6,5.6; B8 -0.8,5.6; B9 0,5.6; B10 0.8,5.6; B11 1.6,5.6; B12 2.4,5.6; B13 3.2,5.6; B14 4,5.6; B15 4.8,5.6; B16 5.6,5.6; B17 6.4,5.6; C1 -6.4,4.8; C2 -5.6,4.8; C3 -4.8,4.8; C4 -4,4.8; C5 -3.2,4.8; C6 -2.4,4.8; C7 -1.6,4.8; C8 -0.8,4.8; C9 0,4.8; C10 0.8,4.8; C11 1.6,4.8; C12 2.4,4.8; C13 3.2,4.8; C14 4,4.8; C15 4.8,4.8; C16 5.6,4.8; C17 6.4,4.8; D1 -6.4,4; D2 -5.6,4; D3 -4.8,4; D4 -4,4; D5 -3.2,4; D6 -2.4,4; D7 -1.6,4; D8 -0.8,4; D9 0,4; D10 0.8,4; D11 1.6,4; D12 2.4,4; D13 3.2,4; D14 4,4; D15 4.8,4; D16 5.6,4; D17 6.4,4; E1 -6.4,3.2; E2 -5.6,3.2; E3 -4.8,3.2; E4 -4,3.2; E5 -3.2,3.2; E6 -2.4,3.2; E7 -1.6,3.2; E8 -0.8,3.2; E9 0,3.2; E10 0.8,3.2; E11 1.6,3.2; E12 2.4,3.2; E13 3.2,3.2; E14 4,3.2; E15 4.8,3.2; E16 5.6,3.2; E17 6.4,3.2; F1 -6.4,2.4; F2 -5.6,2.4; F3 -4.8,2.4; F4 -4,2.4; F5 -3.2,2.4; F13 3.2,2.4; F14 4,2.4; F15 4.8,2.4; F16 5.6,2.4; F17 6.4,2.4; G1 -6.4,1.6; G2 -5.6,1.6; G3 -4.8,1.6; G4 -4,1.6; G5 -3.2,1.6; G7 -1.6,1.6; G8 -0.8,1.6; G9 0,1.6; G10 0.8,1.6; G11 1.6,1.6; G13 3.2,1.6; G14 4,1.6; G15 4.8,1.6; G16 5.6,1.6; G17 6.4,1.6; H1 -6.4,0.8; H2 -5.6,0.8; H3 -4.8,0.8; H4 -4,0.8; H5 -3.2,0.8; H7 -1.6,0.8; H8 -0.8,0.8; H9 0,0.8; H10 0.8,0.8; H11 1.6,0.8; H13 3.2,0.8; H14 4,0.8; H15 4.8,0.8; H16 5.6,0.8; H17 6.4,0.8; J1 -6.4,0; J2 -5.6,0; J3 -4.8,0; J4 -4,0; J5 -3.2,0; J7 -1.6,0; J8 -0.8,0; J9 0,0; J10 0.8,0; J11 1.6,0; J13 3.2,0; J14 4,0; J15 4.8,0; J16 5.6,0; J17 6.4,0; K1 -6.4,-0.8; K2 -5.6,-0.8; K3 -4.8,-0.8; K4 -4,-0.8; K5 -3.2,-0.8; K7 -1.6,-0.8; K8 -0.8,-0.8; K9 0,-0.8; K10 0.8,-0.8; K11 1.6,-0.8; K13 3.2,-0.8; K14 4,-0.8; K15 4.8,-0.8; K16 5.6,-0.8; K17 6.4,-0.8; L1 -6.4,-1.6; L2 -5.6,-1.6; L3 -4.8,-1.6; L4 -4,-1.6; L5 -3.2,-1.6; L7 -1.6,-1.6; L8 -0.8,-1.6; L9 0,-1.6; L10 0.8,-1.6; L11 1.6,-1.6; L13 3.2,-1.6; L14 4,-1.6; L15 4.8,-1.6; L16 5.6,-1.6; L17 6.4,-1.6; M1 -6.4,-2.4; M2 -5.6,-2.4; M3 -4.8,-2.4; M4 -4,-2.4; M5 -3.2,-2.4; M13 3.2,-2.4; M14 4,-2.4; M15 4.8,-2.4; M16 5.6,-2.4; M17 6.4,-2.4; N1 -6.4,-3.2; N2 -5.6,-3.2; N3 -4.8,-3.2; N4 -4,-3.2; N5 -3.2,-3.2; N6 -2.4,-3.2; N7 -1.6,-3.2; N8 -0.8,-3.2; N9 0,-3.2; N10 0.8,-3.2; N11 1.6,-3.2; N12 2.4,-3.2; N13 3.2,-3.2; N14 4,-3.2; N15 4.8,-3.2; N16 5.6,-3.2; N17 6.4,-3.2; P1 -6.4,-4; P2 -5.6,-4; P3 -4.8,-4; P4 -4,-4; P5 -3.2,-4; P6 -2.4,-4; P7 -1.6,-4; P8 -0.8,-4; P9 0,-4; P10 0.8,-4; P11 1.6,-4; P12 2.4,-4; P13 3.2,-4; P14 4,-4; P15 4.8,-4; P16 5.6,-4; P17 6.4,-4; R1 -6.4,-4.8; R2 -5.6,-4.8; R3 -4.8,-4.8; R4 -4,-4.8; R5 -3.2,-4.8; R6 -2.4,-4.8; R7 -1.6,-4.8; R8 -0.8,-4.8; R9 0,-4.8; R10 0.8,-4.8; R11 1.6,-4.8; R12 2.4,-4.8; R13 3.2,-4.8; R14 4,-4.8; R15 4.8,-4.8; R16 5.6,-4.8; R17 6.4,-4.8; T1 -6.4,-5.6; T2 -5.6,-5.6; T3 -4.8,-5.6; T4 -4,-5.6; T5 -3.2,-5.6; T6 -2.4,-5.6; T7 -1.6,-5.6; T8 -0.8,-5.6; T9 0,-5.6; T10 0.8,-5.6; T11 1.6,-5.6; T12 2.4,-5.6; T13 3.2,-5.6; T14 4,-5.6; T15 4.8,-5.6; T16 5.6,-5.6; T17 6.4,-5.6; U1 -6.4,-6.4; U2 -5.6,-6.4; U3 -4.8,-6.4; U4 -4,-6.4; U5 -3.2,-6.4; U6 -2.4,-6.4; U7 -1.6,-6.4; U8 -0.8,-6.4; U9 0,-6.4; U10 0.8,-6.4; U11 1.6,-6.4; U12 2.4,-6.4; U13 3.2,-6.4; U14 4,-6.4; U15 4.8,-6.4; U16 5.6,-6.4; U17 6.4,-6.4
SOT23-5 = smd 0.5 x 1: 1 -0.95,-1.2; 2 0,-1.2; 3 0.95,-1.2; 4 0.95,1.2; 5 -0.95,1.2
TSOT25 = smd 0.55 x 1.2: 1 -0.95,-1.3; 2 0,-1.3; 3 0.95,-1.3; 4 0.95,1.3; 5 -0.95,1.3
SOT-23-6L = smd 0.6 x 1.2: 1 -0.95,-1.15; 2 0,-1.15; 3 0.95,-1.15; 4 0.95,1.15; 5 0,1.15; 6 -0.95,1.15
BGA90 = smd 0.4 x 0.4: A1 -3.2,5.6; A2 -2.4,5.6; A3 -1.6,5.6; A7 1.6,5.6; A8 2.4,5.6; A9 3.2,5.6; B1 -3.2,4.8; B2 -2.4,4.8; B3 -1.6,4.8; B7 1.6,4.8; B8 2.4,4.8; B9 3.2,4.8; C1 -3.2,4; C2 -2.4,4; C3 -1.6,4; C7 1.6,4; C8 2.4,4; C9 3.2,4; D1 -3.2,3.2; D2 -2.4,3.2; D3 -1.6,3.2; D7 1.6,3.2; D8 2.4,3.2; D9 3.2,3.2; E1 -3.2,2.4; E2 -2.4,2.4; E3 -1.6,2.4; E7 1.6,2.4; E8 2.4,2.4; E9 3.2,2.4; F1 -3.2,1.6; F2 -2.4,1.6; F3 -1.6,1.6; F7 1.6,1.6; F8 2.4,1.6; F9 3.2,1.6; G1 -3.2,0.8; G2 -2.4,0.8; G3 -1.6,0.8; G7 1.6,0.8; G8 2.4,0.8; G9 3.2,0.8; H1 -3.2,0; H2 -2.4,0; H3 -1.6,0; H7 1.6,0; H8 2.4,0; H9 3.2,0; J1 -3.2,-0.8; J2 -2.4,-0.8; J3 -1.6,-0.8; J7 1.6,-0.8; J8 2.4,-0.8; J9 3.2,-0.8; K1 -3.2,-1.6; K2 -2.4,-1.6; K3 -1.6,-1.6; K7 1.6,-1.6; K8 2.4,-1.6; K9 3.2,-1.6; L1 -3.2,-2.4; L2 -2.4,-2.4; L3 -1.6,-2.4; L7 1.6,-2.4; L8 2.4,-2.4; L9 3.2,-2.4; M1 -3.2,-3.2; M2 -2.4,-3.2; M3 -1.6,-3.2; M7 1.6,-3.2; M8 2.4,-3.2; M9 3.2,-3.2; N1 -3.2,-4; N2 -2.4,-4; N3 -1.6,-4; N7 1.6,-4; N8 2.4,-4; N9 3.2,-4; P1 -3.2,-4.8; P2 -2.4,-4.8; P3 -1.6,-4.8; P7 1.6,-4.8; P8 2.4,-4.8; P9 3.2,-4.8; R1 -3.2,-5.6; R2 -2.4,-5.6; R3 -1.6,-5.6; R7 1.6,-5.6; R8 2.4,-5.6; R9 3.2,-5.6
MICROUSB-RIGHT = smd 0.4 x 1.35: 1 -1.3,1.27; 2 -0.65,1.27; 3 0,1.27; 4 0.65,1.27; 5 1.3,1.27 | drill 1.1: S1 -3.3,-1.405; S2 3.3,-1.405 | drill 0.7 offset: S3 -2.425,1.275; S4 2.425,1.275 | smd 1.9 x 1.9: S5 -1.2,-1.405; S6 1.2,-1.405
1040310811 = smd 1.2 x 1: CD$1 11.74,10.1; CD$2 11.74,6.4 | smd 1.55 x 1.35: G$1 11.565,0.375 | smd 1.17 x 1.8: G$2 0.245,0.6 | smd 1.9 x 1.35: G$3 2.27,11.075; G$4 8.24,11.075 | smd 0.85 x 1.1: P$1 9.105,0.25; P$2 8.005,0.25; P$3 6.905,0.25; P$4 5.805,0.25; P$5 4.705,0.25; P$6 3.605,0.25; P$7 2.505,0.25 | smd 0.75 x 1.1: P$8 1.455,0.25
DF12-36-DS = smd 0.3 x 1.6: 1 4.25,-1.8; 2 4.25,1.8; 3 3.75,-1.8; 4 3.75,1.8; 5 3.25,-1.8; 6 3.25,1.8; 7 2.75,-1.8; 8 2.75,1.8; 9 2.25,-1.8; 10 2.25,1.8; 11 1.75,-1.8; 12 1.75,1.8; 13 1.25,-1.8; 14 1.25,1.8; 15 0.75,-1.8; 16 0.75,1.8; 17 0.25,-1.8; 18 0.25,1.8; 19 -0.25,-1.8; 20 -0.25,1.8; 21 -0.75,-1.8; 22 -0.75,1.8; 23 -1.25,-1.8; 24 -1.25,1.8; 25 -1.75,-1.8; 26 -1.75,1.8; 27 -2.25,-1.8; 28 -2.25,1.8; 29 -2.75,-1.8; 30 -2.75,1.8; 31 -3.25,-1.8; 32 -3.25,1.8; 33 -3.75,-1.8; 34 -3.75,1.8; 35 -4.25,-1.8; 36 -4.25,1.8 | smd 0.9 x 1.8: F1 6,0; F2 -6,0 | hole 0.6: 5.3,-1.5; -5.3,-1.5
JST-PH-2-THM-RA = drill 0.8 pad 1.422: 1 1,0; 2 -1,0
CRYSTAL-2.5X2.0 = smd 1 x 0.9: 1 -0.95,-0.8; 2 0.9,-0.8; 3 0.9,0.75; 4 -0.95,0.75

### Placement (x,y rotation side)
C1  26.29,7.75 90 bottom
C2  18.01,5.42 90 top
C3  11.65,2.57 270 top
C4  23.68,36.5 90 top
C5  29.45,36.48 90 top
C6  25.65,41.66 90 top
C7  32.03,27.76 270 top
C8  34.12,28.1 90 top
C9  22.75,27.7 0 bottom
C10  31.66,21.97 0 top
C11  1.79,27.41 180 top
C12  1.79,28.7 180 top
C13  21.7,34.7 90 top
C14  6.98,22.92 180 top
C15  23.4,16.52 270 top
C16  28.06,26.92 180 top
C17  19.12,16.64 270 top
C26  27.07,17.49 270 bottom
C27  6.93,21.54 180 top
C28  9.78,34.92 90 bottom
C29  25.71,17.52 270 bottom
C30  8.36,13.21 90 bottom
C31  17.28,24.05 90 bottom
C32  16.05,24.03 90 bottom
C33  14.8,24.02 90 bottom
C34  19.19,27.03 270 bottom
C35  17.96,27.03 270 bottom
C36  16.66,27.04 270 bottom
C37  6.03,31.28 180 bottom
C38  15.35,27.03 270 bottom
C39  19.75,24.06 90 bottom
C40  18.53,24.08 90 bottom
C41  7,24.17 180 top
C42  21.48,16.67 270 top
C46  28.05,33 180 top
C47  28.12,28.26 0 top
D1  20.68,0.97 180 top
H1  3.05,41.4 90 top
H2  32.51,41.4 270 top
JP1  1.65,10.41 270 top
JP2  33.91,10.41 270 top
JP3  30.1,12.95 270 top
L1  15.58,1.27 270 top
L2  4.03,28.18 90 top
LED1  2.17,31.69 180 top
LED2  28.32,41.91 90 top
LED3  7.24,41.91 270 top
M1  2.54,36.2 0 top
M2  33.02,36.2 0 top
Q1  7.11,37.08 0 bottom
Q2  20.68,4.02 0 top
R1  26.62,20.71 0 top
R2  13.08,2.29 270 top
R3  13.18,5.29 270 top
R4  7.09,34.58 180 bottom
R5  9.78,37.85 90 bottom
R6  9.02,41.15 90 top
R7  10.29,41.15 90 top
R8  14.58,17.4 0 top
R9  4.11,24.52 270 top
R10  15.86,35.37 270 top
R12  18.11,1.59 270 top
RN2  32.3,31.8 0 top
RN3  5.6,31.35 270 top
RN6  29.89,24.29 0 top
U1  6.06,24.59 270 bottom
U2  17.19,25.68 270 top
U3  26.67,36.2 270 top
U4  15.6,4.4 180 top
U5  26.29,7.75 0 top
U$1  [WEEE]  8.68,7.75 0 bottom
U$2  [ROHS]  9.45,0.71 0 bottom
U$3  [OMV-LOGO]  27.87,39.15 0 bottom
U$4  [OMV-LOGO-SMALL]  12.11,10.07 0 top
U$5  16.55,11.34 90 bottom
X1  26.67,2.86 0 top
X2  34.92,33.15 270 bottom
X3  17.78,40.64 0 top
X4  7.68,6.33 180 top
Y1  28.06,30.63 90 top

### Tracks (layer width: path | path; a pad name or v marks a point on that pad's centre or on a via)
BOOT0  (2 unrouted)
DAC  (1 unrouted)
DCMI_CLK  (1 unrouted)
DCMI_D0  (1 unrouted)
DCMI_D1  (1 unrouted)
DCMI_D2  (1 unrouted)
DCMI_D3  (1 unrouted)
DCMI_D4  (1 unrouted)
DCMI_D5  (1 unrouted)
DCMI_D6  (1 unrouted)
DCMI_D7  (1 unrouted)
DCMI_FSIN  (1 unrouted)
DCMI_HSYNC  (1 unrouted)
DCMI_PCLK  (1 unrouted)
DCMI_PWDN  (2 unrouted)
DCMI_RST  (1 unrouted)
DCMI_VSYNC  (1 unrouted)
DRAM_A0  (1 unrouted)
DRAM_A1  (1 unrouted)
DRAM_A2  (1 unrouted)
DRAM_A3  (1 unrouted)
DRAM_A4  (1 unrouted)
DRAM_A5  (1 unrouted)
DRAM_A6  (1 unrouted)
DRAM_A7  (1 unrouted)
DRAM_A8  (1 unrouted)
DRAM_A9  (1 unrouted)
DRAM_A10  (1 unrouted)
DRAM_A11  (1 unrouted)
DRAM_BA0  (1 unrouted)
DRAM_BA1  (1 unrouted)
DRAM_CAS  (1 unrouted)
DRAM_CLK  (1 unrouted)
DRAM_CLKE  (1 unrouted)
DRAM_CS  (2 unrouted)
DRAM_D0  (1 unrouted)
DRAM_D1  (1 unrouted)
DRAM_D2  (1 unrouted)
DRAM_D3  (1 unrouted)
DRAM_D4  (1 unrouted)
DRAM_D5  (1 unrouted)
DRAM_D6  (1 unrouted)
DRAM_D7  (1 unrouted)
DRAM_D8  (1 unrouted)
DRAM_D9  (1 unrouted)
DRAM_D10  (1 unrouted)
DRAM_D11  (1 unrouted)
DRAM_D12  (1 unrouted)
DRAM_D13  (1 unrouted)
DRAM_D14  (1 unrouted)
DRAM_D15  (1 unrouted)
DRAM_D16  (1 unrouted)
DRAM_D17  (1 unrouted)
DRAM_D18  (1 unrouted)
DRAM_D19  (1 unrouted)
DRAM_D20  (1 unrouted)
DRAM_D21  (1 unrouted)
DRAM_D22  (1 unrouted)
DRAM_D23  (1 unrouted)
DRAM_D24  (1 unrouted)
DRAM_D25  (1 unrouted)
DRAM_D26  (1 unrouted)
DRAM_D27  (1 unrouted)
DRAM_D28  (1 unrouted)
DRAM_D29  (1 unrouted)
DRAM_D30  (1 unrouted)
DRAM_D31  (1 unrouted)
DRAM_DQM0  (1 unrouted)
DRAM_DQM1  (1 unrouted)
DRAM_DQM2  (1 unrouted)
DRAM_DQM3  (1 unrouted)
DRAM_RAS  (1 unrouted)
DRAM_WE  (1 unrouted)
FLASH_!CS  (2 unrouted)
FLASH_CLK  (1 unrouted)
FLASH_IO0  (1 unrouted)
FLASH_IO1  (1 unrouted)
FLASH_IO2  (1 unrouted)
FLASH_IO3  (1 unrouted)
FS_DM  (1 unrouted)
FS_DP  (1 unrouted)
GND  (127 unrouted)
  pour GND (no thermals): 0,0 0,44.45 35.56,44.45 35.56,0
  pour Top (isolate 0.254, rank 5): 27.65,3.49 27.65,7.36 30.69,7.36 30.69,3.49
  pour Bottom (no thermals): 35.31,30.05 31.62,30.05 31.62,28.96 35.31,28.96
  pour Top (no thermals): 31.24,30.1 35.31,30.1 35.31,28.19 31.24,28.19
  pour Top (rank 5): 22.48,4.83 30.99,4.83 30.99,0.25 22.48,0.25
  pour Bottom: 25.65,7.62 31.11,7.62 31.11,5.08 25.65,5.08
  pour Top (no thermals): 15.21,27.39 15.21,23.77 15.19,23.75 19.08,23.75 19.11,23.77 19.11,27.45 19.15,27.49 15.34,27.49 15.22,27.37
  pour Top (no thermals): 17.36,4.93 17.36,1.9 17.38,1.88 17.42,1.84 18.6,1.84 18.6,4.88 18.52,4.95 17.38,4.95
  pour Top (no thermals): 24.97,36.46 24.97,35.94 25.05,35.86 28.61,35.86 28.72,35.75 28.72,34.81 28.27,34.36 28.27,31.13 28.4,31.01 29.51,31.01 30.12,31.63 30.12,36.27 29.93,36.47 24.98,36.47 24.96,36.45 24.96,36.41
  pour Top (no thermals): 24.19,36.33 24.18,36.32 21.03,36.32 21.03,35.28 24.01,35.28 24.21,35.47 24.21,36.33
  pour Top (no thermals): 0.31,29.42 0.32,29.41 0.32,25.8 0.36,25.77 1.64,25.77 1.66,25.78 1.66,29.3 1.52,29.44 0.28,29.44
  pour Bottom (isolate 0.254): 0.21,44.29 0.05,44.12 0.05,-0.05 35.55,-0.05 35.64,0.05 35.64,44.23 35.47,44.4 0.35,44.4 0.24,44.3
I2C1_SCL  (2 unrouted)
I2C1_SDA  (2 unrouted)
I2C2_SCL  (1 unrouted)
I2C2_SDA  (1 unrouted)
LED_B  (1 unrouted)
LED_G  (1 unrouted)
LED_IR  (1 unrouted)
LED_R  (1 unrouted)
N$2  (1 unrouted)
N$4  (1 unrouted)
N$5  (2 unrouted)
N$6  (1 unrouted)
N$8  (1 unrouted)
N$9  (1 unrouted)
N$10  (1 unrouted)
N$13  (2 unrouted)
N$14  (1 unrouted)
N$17  (1 unrouted)
N$30  (4 unrouted)
N$32  (1 unrouted)
N$33  (2 unrouted)
N$34  (2 unrouted)
NRST  (4 unrouted)
P9  (1 unrouted)
RAW  (4 unrouted)
  pour Top (isolate 0.254, rank 2, no thermals): 22.33,4.27 22.33,0.21 20.68,0.21 20.68,3.79 18.9,3.79 18.9,5.27 14.43,5.27 14.43,6.94 19.91,6.94 19.91,4.27
SD_CD  (2 unrouted)
SDIO_CLK  (1 unrouted)
SDIO_CMD  (2 unrouted)
SDIO_D0  (2 unrouted)
SDIO_D1  (2 unrouted)
SDIO_D2  (2 unrouted)
SDIO_D3  (2 unrouted)
SPI2_MISO  (1 unrouted)
SPI2_MOSI  (1 unrouted)
SPI2_NSS  (1 unrouted)
SPI2_SCLK  (1 unrouted)
SPI3_MISO  (1 unrouted)
SPI3_MOSI  (1 unrouted)
SPI3_SCLK/TRACESWO  (2 unrouted)
SPI3_SSEL  (1 unrouted)
SW  (1 unrouted)
  pour Top (isolate 0.254, no thermals): 16,3.77 16.99,3.77 16.99,0.25 16,0.25
SWCLK  (1 unrouted)
SWDIO  (1 unrouted)
TIM4_CH1  (1 unrouted)
TIM4_CH2  (1 unrouted)
VBUS  (4 unrouted)
  pour Top (no thermals): 20.17,5.93 22.42,5.93 22.42,4.53 20.17,4.53
VCAP1  (1 unrouted)
VCAP3  (1 unrouted)
VCAP4  (1 unrouted)
VCC  (93 unrouted)
  pour Top (isolate 0.254, no thermals): 2.17,31.57 2.17,29.61 3.56,29.61 3.56,31.57
  pour Top (isolate 0.254, no thermals): 21.97,44.2 21.97,42.42 26.42,42.42 26.42,44.2
  pour Top (isolate 0.254, no thermals): 22.99,39.24 25.91,39.24 25.91,36.78 22.99,36.78
  pour Top (isolate 0.254, no thermals): 12.7,43.56 12.7,42.19 13.65,42.19 13.65,43.56
  pour Top (isolate 0.254, rank 5, no thermals): 31.24,27.94 35.31,27.94 35.31,25.78 31.24,25.78
  pour Top (no thermals): 10.52,2.25 10.52,0.42 10.64,0.3 14.69,0.3 14.85,0.46 14.85,2.13 14.76,2.23 10.54,2.23 10.51,2.26
  pour Route5: 0.08,44.39 0.08,0.08 0.04,0.04 35.48,0.04 35.52,0.07 35.52,44.2 35.38,44.34
VDDA  (2 unrouted)
  pour Bottom (isolate 0.254, rank 2, no thermals): 27.62,39.24 26.42,39.24 26.42,37.54 27.62,37.54
  pour Top (isolate 0.254, rank 2, no thermals): 26.42,36.83 30.35,36.83 30.35,38.42 27.62,38.42 27.62,39.24 26.42,39.24
VIN  (4 unrouted)
  pour Top (isolate 0.254, no thermals): 17.37,0.21 17.37,1.48 19.22,1.48 19.22,3.41 20.17,3.41 20.17,0.21

### Text on the board
tPlace: P0 | SWO | RST | P1 | SWC | BOOT | P2 | SWD | SYN | P3 | RST | P9 | P4 | P8 | 3.3v | P5 | GND | P7 | P6 | VIN | 3.3V | GND
bPlace: https://openmv.io | OpenMV4-Plus Alt R2 | 06/01/2021 | P0 | SWO | RST | P1 | SWC | BOOT | P2 | SWD | SYN | P3 | RST | P9 | P4 | P8 | 3.3v | P5 | Max voltage: 5v | GND | P7 | P6 | VIN | 3.3V | GND